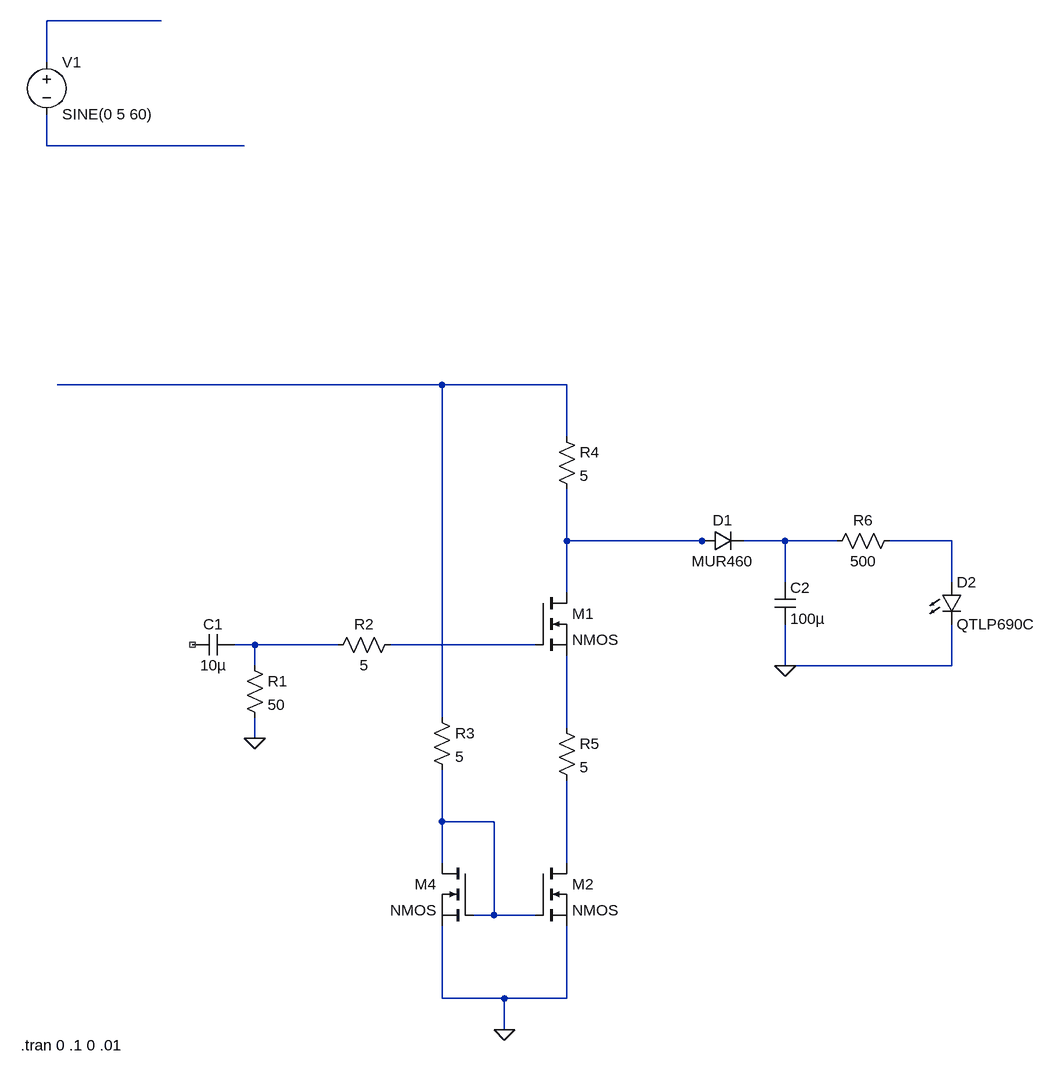
[diagram p0: schematic Draft2.asc]
Draft2.asc, the LTspice schematic file:
Version 4
SHEET 1 1752 744
WIRE 96 -848 -80 -848
WIRE -80 -784 -80 -848
WIRE -80 -656 -80 -704
WIRE 224 -656 -80 -656
WIRE 528 -288 -64 -288
WIRE 720 -288 528 -288
WIRE 720 -208 720 -288
WIRE 720 -48 720 -128
WIRE 928 -48 720 -48
WIRE 944 -48 928 -48
WIRE 1056 -48 992 -48
WIRE 1136 -48 1056 -48
WIRE 1312 -48 1216 -48
WIRE 1056 16 1056 -48
WIRE 1312 16 1312 -48
WIRE 720 32 720 -48
WIRE 240 112 208 112
WIRE 368 112 240 112
WIRE 672 112 448 112
WIRE 240 144 240 112
WIRE 1056 144 1056 80
WIRE 1312 144 1312 80
WIRE 1312 144 1056 144
WIRE 528 224 528 -288
WIRE 720 240 720 128
WIRE 240 256 240 224
WIRE 528 384 528 304
WIRE 608 384 528 384
WIRE 528 448 528 384
WIRE 720 448 720 320
WIRE 608 528 608 384
WIRE 608 528 576 528
WIRE 672 528 608 528
WIRE 528 656 528 544
WIRE 624 656 528 656
WIRE 720 656 720 544
WIRE 720 656 624 656
WIRE 624 704 624 656
FLAG 240 256 0
FLAG 624 704 0
FLAG 1056 144 0
SYMBOL cap 208 96 R90
WINDOW 0 0 32 VBottom 2
WINDOW 3 32 32 VTop 2
SYMATTR InstName C1
SYMATTR Value 10µ
SYMATTR SpiceLine ""
SYMBOL res 224 128 R0
SYMATTR InstName R1
SYMATTR Value 50
SYMATTR SpiceLine ""
SYMBOL res 464 96 R90
WINDOW 0 0 56 VBottom 2
WINDOW 3 32 56 VTop 2
SYMATTR InstName R2
SYMATTR Value 5
SYMATTR SpiceLine ""
SYMBOL nmos 672 32 R0
SYMATTR InstName M1
SYMBOL res 704 -224 R0
SYMATTR InstName R4
SYMATTR Value 5
SYMATTR SpiceLine ""
SYMBOL res 704 224 R0
SYMATTR InstName R5
SYMATTR Value 5
SYMATTR SpiceLine ""
SYMBOL nmos 672 448 R0
SYMATTR InstName M2
SYMBOL nmos 576 448 M0
SYMATTR InstName M4
SYMBOL res 512 208 R0
SYMATTR InstName R3
SYMATTR Value 5
SYMATTR SpiceLine ""
SYMBOL diode 928 -32 R270
WINDOW 0 32 32 VTop 2
WINDOW 3 0 32 VBottom 2
SYMATTR InstName D1
SYMATTR Value MUR460
SYMBOL cap 1040 16 R0
SYMATTR InstName C2
SYMATTR Value 100µ
SYMATTR SpiceLine ""
SYMBOL res 1232 -64 R90
WINDOW 0 0 56 VBottom 2
WINDOW 3 32 56 VTop 2
SYMATTR InstName R6
SYMATTR Value 500
SYMATTR SpiceLine ""
SYMBOL LED 1296 16 R0
SYMATTR InstName D2
SYMATTR Value QTLP690C
SYMBOL voltage -80 -800 R0
WINDOW 123 0 0 Left 2
WINDOW 39 0 0 Left 2
SYMATTR Value2 ""
SYMATTR SpiceLine ""
SYMATTR InstName V1
SYMATTR Value SINE(0 5 60)
TEXT -120 728 Left 2 !.tran 0 .1 0 .01

The netlist it stands for:
* Draft2.asc
C1 N007 NC_01 10µ
R1 N007 0 50
R2 N008 N007 5
M1 N004 N008 N009 N009 NMOS
R4 N003 N004 5
R5 N009 N011 5
M2 N011 N010 0 0 NMOS
M4 N010 N010 0 0 NMOS
R3 N003 N010 5
D1 N004 N005 MUR460
C2 N005 0 100µ
R6 N006 N005 500
D2 N006 0 QTLP690C
V1 N001 N002 SINE(0 5 60)
.model D D
.lib standard.dio
.model NMOS NMOS
.model PMOS PMOS
.lib standard.mos
.tran 0 .1 0 .01
.backanno
.end